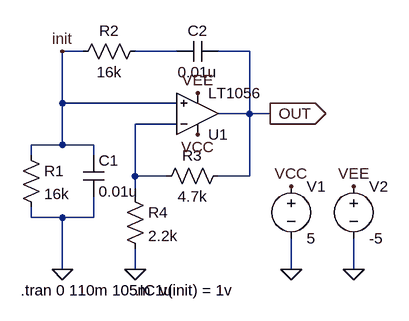
[diagram p0: schematic 2-3_WienBridgeOscillator.asc]
2-3_WienBridgeOscillator.asc, the LTspice schematic file:
Version 4.1
SHEET 1 880 680
WIRE 176 -80 144 -80
WIRE 320 -80 256 -80
WIRE 432 -80 384 -80
WIRE 144 0 144 -80
WIRE 320 0 144 0
WIRE 432 16 432 -80
WIRE 432 16 384 16
WIRE 464 16 432 16
WIRE 320 32 256 32
WIRE 144 64 144 0
WIRE 144 64 96 64
WIRE 192 64 144 64
WIRE 96 80 96 64
WIRE 192 80 192 64
WIRE 256 112 256 32
WIRE 304 112 256 112
WIRE 432 112 432 16
WIRE 432 112 384 112
WIRE 256 144 256 112
WIRE 96 176 96 160
WIRE 144 176 96 176
WIRE 192 176 192 144
WIRE 192 176 144 176
WIRE 144 256 144 176
WIRE 256 256 256 224
WIRE 496 256 496 208
WIRE 592 256 592 208
FLAG 256 256 0
FLAG 144 256 0
FLAG 496 256 0
FLAG 592 256 0
FLAG 352 48 VCC
FLAG 496 128 VCC
FLAG 352 -16 VEE
FLAG 592 128 VEE
FLAG 144 -80 init
FLAG 464 16 OUT
IOPIN 464 16 Out
SYMBOL res 80 64 R0
SYMATTR InstName R1
SYMATTR Value 16k
SYMBOL cap 176 80 R0
SYMATTR InstName C1
SYMATTR Value 0.01u
SYMBOL res 272 -96 R90
WINDOW 0 0 56 VBottom 2
WINDOW 3 32 56 VTop 2
SYMATTR InstName R2
SYMATTR Value 16k
SYMBOL cap 384 -96 R90
WINDOW 0 0 32 VBottom 2
WINDOW 3 32 32 VTop 2
SYMATTR InstName C2
SYMATTR Value 0.01u
SYMBOL res 400 96 R90
WINDOW 0 0 56 VBottom 2
WINDOW 3 32 56 VTop 2
SYMATTR InstName R3
SYMATTR Value 4.7k
SYMBOL res 240 128 R0
SYMATTR InstName R4
SYMATTR Value 2.2k
SYMBOL voltage 496 112 R0
WINDOW 123 0 0 Left 0
WINDOW 39 0 0 Left 0
SYMATTR InstName V1
SYMATTR Value 5
SYMBOL voltage 592 112 R0
WINDOW 123 0 0 Left 0
WINDOW 39 0 0 Left 0
SYMATTR InstName V2
SYMATTR Value -5
SYMBOL OpAmps\\LT1056 352 80 M180
SYMATTR InstName U1
TEXT 256 288 Left 2 !.IC v(init) = 1v
TEXT 80 288 Left 2 !.tran 0 110m 105m 1u

The netlist it stands for:
* 2-3_WienBridgeOscillator.asc
R1 init 0 16k
C1 init 0 0.01u
R2 N001 init 16k
C2 OUT N001 0.01u
R3 OUT N002 4.7k
R4 N002 0 2.2k
V1 VCC 0 5
V2 VEE 0 -5
X§U1 init N002 VCC VEE OUT LT1056  ; pins In+ In- V+ V- OUT
.IC v(init) = 1v
.tran 0 110m 105m 1u
.backanno
.end